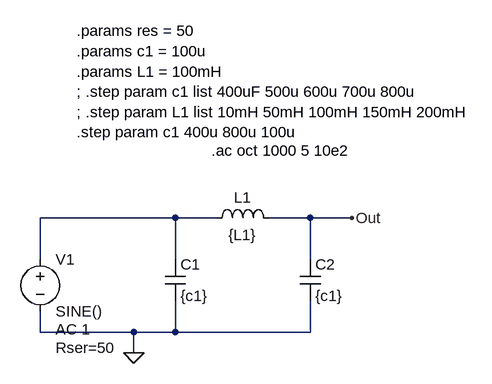
[diagram p0: schematic PiFilter-2.asc]
PiFilter-2.asc, the LTspice schematic file:
Version 4
SHEET 1 892 680
WIRE 64 64 -144 64
WIRE 128 64 64 64
WIRE 272 64 208 64
WIRE 336 64 272 64
WIRE -144 128 -144 64
WIRE 64 128 64 64
WIRE 272 128 272 64
WIRE -144 240 -144 208
WIRE 0 240 -144 240
WIRE 64 240 64 192
WIRE 64 240 0 240
WIRE 272 240 272 192
WIRE 272 240 64 240
WIRE 0 272 0 240
FLAG 0 272 0
FLAG 336 64 Out
SYMBOL cap 48 128 R0
SYMATTR InstName C1
SYMATTR Value {c1}
SYMBOL cap 256 128 R0
SYMATTR InstName C2
SYMATTR Value {c1}
SYMBOL ind 112 80 R270
WINDOW 0 32 56 VTop 2
WINDOW 3 5 56 VBottom 2
SYMATTR InstName L1
SYMATTR Value {L1}
SYMBOL voltage -144 112 R0
WINDOW 123 24 124 Left 2
WINDOW 39 24 152 Left 2
SYMATTR Value2 AC 1
SYMATTR SpiceLine Rser=50
SYMATTR InstName V1
SYMATTR Value SINE()
TEXT -88 -224 Left 2 !.params res = 50\n.params c1 = 100u\n.params L1 = 100mH\n; .step param c1 list 400uF 500u 600u 700u 800u\n; .step param L1 list 10mH 50mH 100mH 150mH 200mH\n.step param c1 400u 800u 100u
TEXT 120 -40 Left 2 !.ac oct 1000 5 10e2

The netlist it stands for:
* PiFilter-2.asc
C1 N001 0 {c1}
C2 Out 0 {c1}
L1 N001 Out {L1}
V1 N001 0 SINE() AC 1 Rser=50
.params res = 50
.params c1 = 100u
.params L1 = 100mH
; .step param c1 list 400uF 500u 600u 700u 800u
; .step param L1 list 10mH 50mH 100mH 150mH 200mH
.step param c1 400u 800u 100u
.ac oct 1000 5 10e2
.backanno
.end